# EAGLE design moduloAcionamento2 (EAGLE 9.5.2)
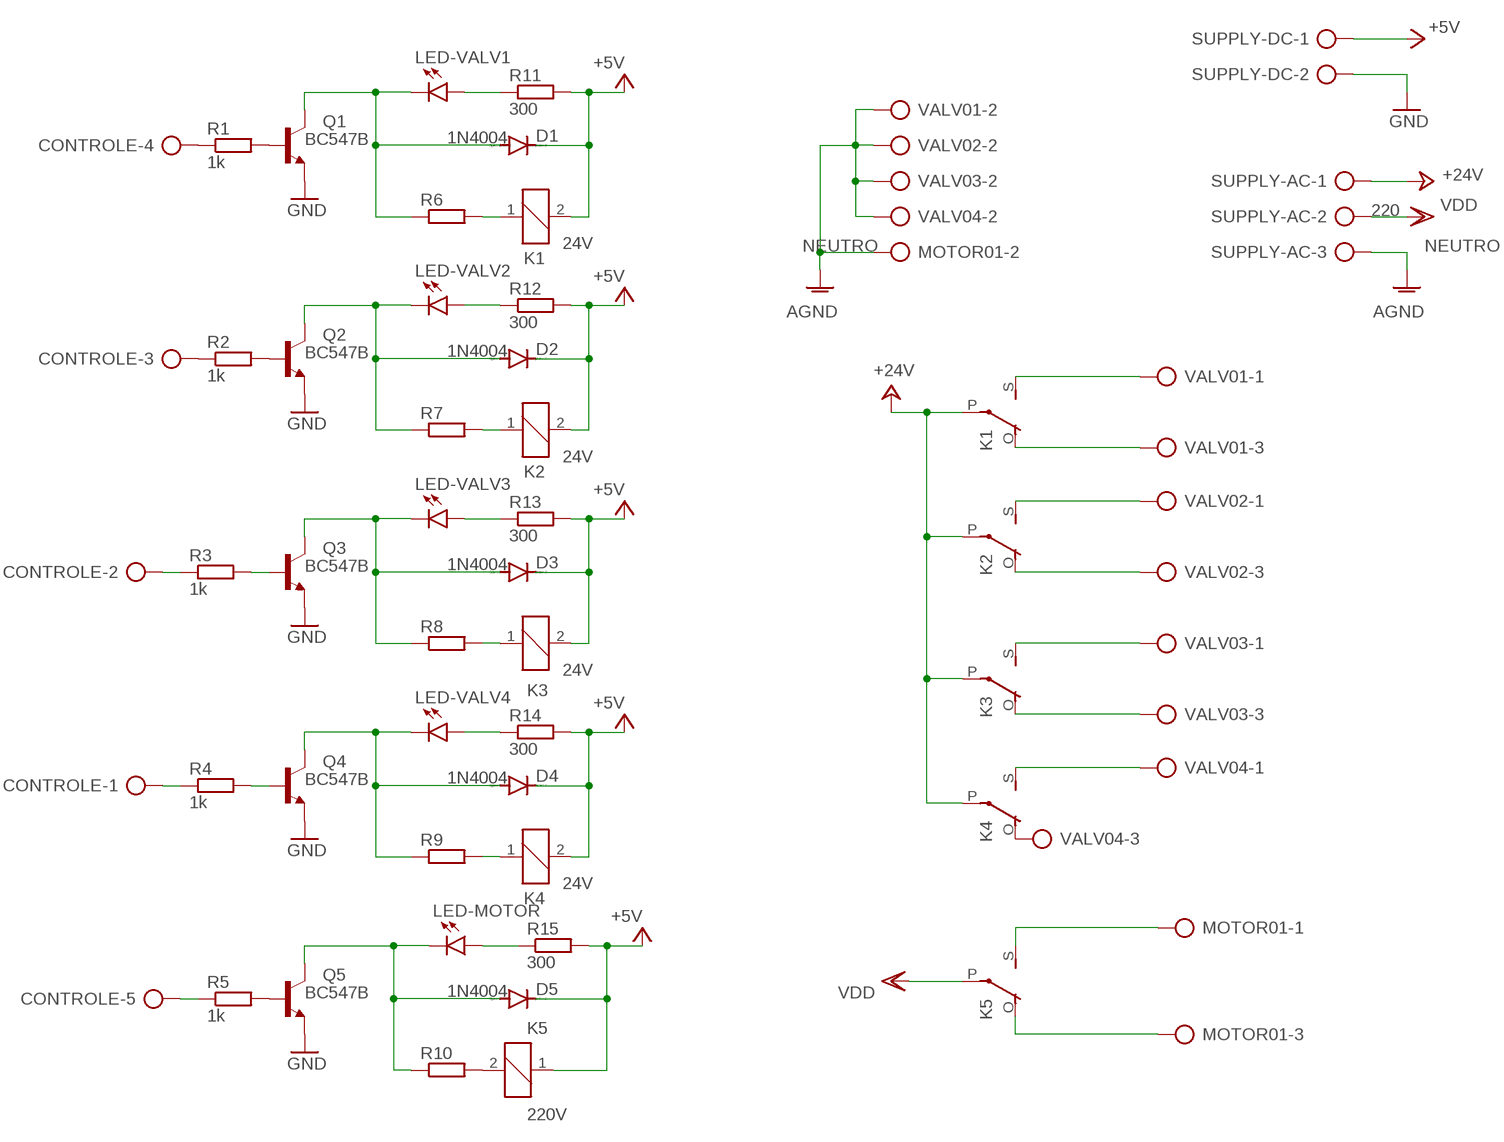
[diagram p0: schematic, sheet 1]

## Parts
CONTROLE  AK500/5  [AK500/5]
D1  1N4004  [DO41-10]
D2  1N4004  [DO41-10]
D3  1N4004  [DO41-10]
D4  1N4004  [DO41-10]
D5  1N4004  [DO41-10]
K1  24V  G5L  [G5LE]
K2  24V  G5L  [G5LE]
K3  24V  G5L  [G5LE]
K4  24V  G5L  [G5LE]
K5  220V  G5L  [G5LE]
LED-MOTOR  LED5MM  [LED5MM]
LED-VALV1  LED5MM  [LED5MM]
LED-VALV2  LED5MM  [LED5MM]
LED-VALV3  LED5MM  [LED5MM]
LED-VALV4  LED5MM  [LED5MM]
MOTOR01  AK500/3  [AK500/3]
Q1  BC547B  [TO92]
Q2  BC547B  [TO92]
Q3  BC547B  [TO92]
Q4  BC547B  [TO92]
Q5  BC547B  [TO92]
R1  1k  R-EU_0204/7  [0204/7]
R2  1k  R-EU_0204/7  [0204/7]
R3  1k  R-EU_0204/7  [0204/7]
R4  1k  R-EU_0204/7  [0204/7]
R5  1k  R-EU_0204/7  [0204/7]
R6  R-EU_0204/7  [0204/7]
R7  R-EU_0204/7  [0204/7]
R8  R-EU_0204/7  [0204/7]
R9  R-EU_0204/7  [0204/7]
R10  R-EU_0204/7  [0204/7]
R11  300  R-EU_0204/7  [0204/7]
R12  300  R-EU_0204/7  [0204/7]
R13  300  R-EU_0204/7  [0204/7]
R14  300  R-EU_0204/7  [0204/7]
R15  300  R-EU_0204/7  [0204/7]
SUPPLY-AC  AK500/3  [AK500/3]
SUPPLY-DC  AK500/2  [AK500/2]
VALV01  AK500/3  [AK500/3]
VALV02  AK500/3  [AK500/3]
VALV03  AK500/3  [AK500/3]
VALV04  AK500/3  [AK500/3]

## Nets
220: K5.P(2:P) SUPPLY-AC.2 ; supply symbol labelled VDD
+5V: D1.C D2.C D3.C D4.C D5.C K1.2 K2.2 K3.2 K4.2 K5.1 R11.2 R12.2 R13.2 R14.2 R15.2 SUPPLY-DC.1
+24V: K1.P(2:P) K2.P(2:P) K3.P(2:P) K4.P(2:P) SUPPLY-AC.1
GND: Q1.1(E) Q2.1(E) Q3.1(E) Q4.1(E) Q5.1(E) SUPPLY-DC.2
N$1: Q1.2(B) R1.2
N$2: K1.1 R6.2
N$3: D2.A LED-VALV2.K(C) Q2.3(C) R7.1
N$4: CONTROLE.4 R1.1
N$5: K3.1 R8.2
N$6: LED-VALV1.A R11.1
N$7: CONTROLE.3 R2.1
N$8: Q2.2(B) R2.2
N$9: Q3.2(B) R3.2
N$10: D4.A LED-VALV4.K(C) Q4.3(C) R9.1
N$11: CONTROLE.2 R3.1
N$12: CONTROLE.1 R4.1
N$13: Q4.2(B) R4.2
N$14: CONTROLE.5 R5.1
N$15: Q5.2(B) R5.2
N$16: K1.O(2:O) VALV01.3
N$17: K1.S(2:S) VALV01.1
N$18: K2.S(2:S) VALV02.1
N$19: K2.O(2:O) VALV02.3
N$20: K3.S(2:S) VALV03.1
N$21: K3.O(2:O) VALV03.3
N$22: K4.S(2:S) VALV04.1
N$23: K4.O(2:O) VALV04.3
N$24: K5.S(2:S) MOTOR01.1
N$25: LED-VALV2.A R12.1
N$26: K2.1 R7.2
N$27: K4.1 R9.2
N$28: D5.A LED-MOTOR.K(C) Q5.3(C) R10.1
N$29: K5.2 R10.2
N$30: LED-VALV3.A R13.1
N$31: LED-VALV4.A R14.1
N$32: D1.A LED-VALV1.K(C) Q1.3(C) R6.1
N$33: D3.A LED-VALV3.K(C) Q3.3(C) R8.1
N$34: LED-MOTOR.A R15.1
N$35: K5.O(2:O) MOTOR01.3
NEUTRO: MOTOR01.2 SUPPLY-AC.3 VALV01.2 VALV02.2 VALV03.2 VALV04.2 ; supply symbol labelled AGND

## Library data of the parts
CONTROLE = con-ptr500:AK500/5: CONNECTOR; OC_FARNELL: unknown; OC_NEWARK: unknown
D1-D5 = diode:1N4004: DIODE general purpose rectifier, 1 A
K1-K5 = relay:G5L: RELAY 1 x switch, 10 A/120 V AC, 8 A/30 V ADC, Omron; OC_FARNELL: unknown; OC_NEWARK: unknown
LED-MOTOR LED-VALV1-LED-VALV4 = led:LED: LED OSRAM: - CHIPLED LG R971, LG N971, LY N971, LG Q971, LY Q971, LO R971, LY R971 LH N974, LH R974 LS Q976, LO Q976, LY Q976 LO Q996 - Hyper CHIPLED LW Q18S LB Q993, LB Q99A, LB R99A - SideLED LS A670, LO A670, LY A670, LG A670, LP A670 LB A673, LV A673, LT A673, LW A673 LH A674 LY A675 LS A676, LA A676, LO A676, LY A676, LW A676 LS A679, LY A679, LG A679 - Hyper Micro SIDELED® LS Y876, LA Y876, LO Y876, LY Y876 LT Y87S - SmartLED LW L88C, LW L88S LB L89C, LB L89S, LG L890 LS L89K, LO L89K, LY L89K LS L896, LA L896, LO L896, LY L896 - TOPLED LS T670, LO T670, LY T670, LG T670, LP T670 LSG T670, LSP T670, LSY T670, LOP T670, LYG T670 LG T671, LOG T671, LSG T671 LB T673, LV T673, LT T673, LW T673 LH T674 LS T676, LA T676, LO T676, LY T676, LB T676, LH T676, LSB T676, LW T676 LB T67C, LV T67C, LT T67C, LS T67K, LO T67K, LY T67K, LW E67C LS E67B, LA E67B, LO E67B, LY E67B, LB E67C, LV E67C, LT E67C LW T67C LS T679, LY T679, LG T679 LS T770, LO T770, LY T770, LG T770, LP T770 LB T773, LV T773, LT T773, LW T773 LH T774 LS E675, LA E675, LY E675, LS T675 LS T776, LA T776, LO T776, LY T776, LB T776 LHGB T686 LT T68C, LB T68C - Hyper Mini TOPLED® LB M676 - Mini TOPLED Santana® LG M470 LS M47K, LO M47K, LY M47K Source: http://www.osram.convergy.de LUXEON: - LUMILED® LXK2-PW12-R00, LXK2-PW12-S00, LXK2-PW14-U00, LXK2-PW14-V00 LXK2-PM12-R00, LXK2-PM12-S00, LXK2-PM14-U00 LXK2-PE12-Q00, LXK2-PE12-R00, LXK2-PE12-S00, LXK2-PE14-T00, LXK2-PE14-U00 LXK2-PB12-K00, LXK2-PB12-L00, LXK2-PB12-M00, LXK2-PB14-N00, LXK2-PB14-P00, LXK2-PB14-Q00 LXK2-PR12-L00, LXK2-PR12-M00, LXK2-PR14-Q00, LXK2-PR14-R00 LXK2-PD12-Q00, LXK2-PD12-R00, LXK2-PD12-S00 LXK2-PH12-R00, LXK2-PH12-S00 LXK2-PL12-P00, LXK2-PL12-Q00, LXK2-PL12-R00 Source: www.luxeon.com KINGBRIGHT: KA-3528ASYC Source: www.kingbright.com
MOTOR01 SUPPLY-AC VALV01-VALV04 = con-ptr500:AK500/3: CONNECTOR; OC_FARNELL: unknown; OC_NEWARK: unknown
Q1-Q5 = transistor-npn:BC547*: NPN Transistor
R1-R15 = rcl:R-EU_: RESISTOR, European symbol; SPICEPREFIX: R
SUPPLY-DC = con-ptr500:AK500/2: CONNECTOR; OC_FARNELL: unknown; OC_NEWARK: unknown

## Board
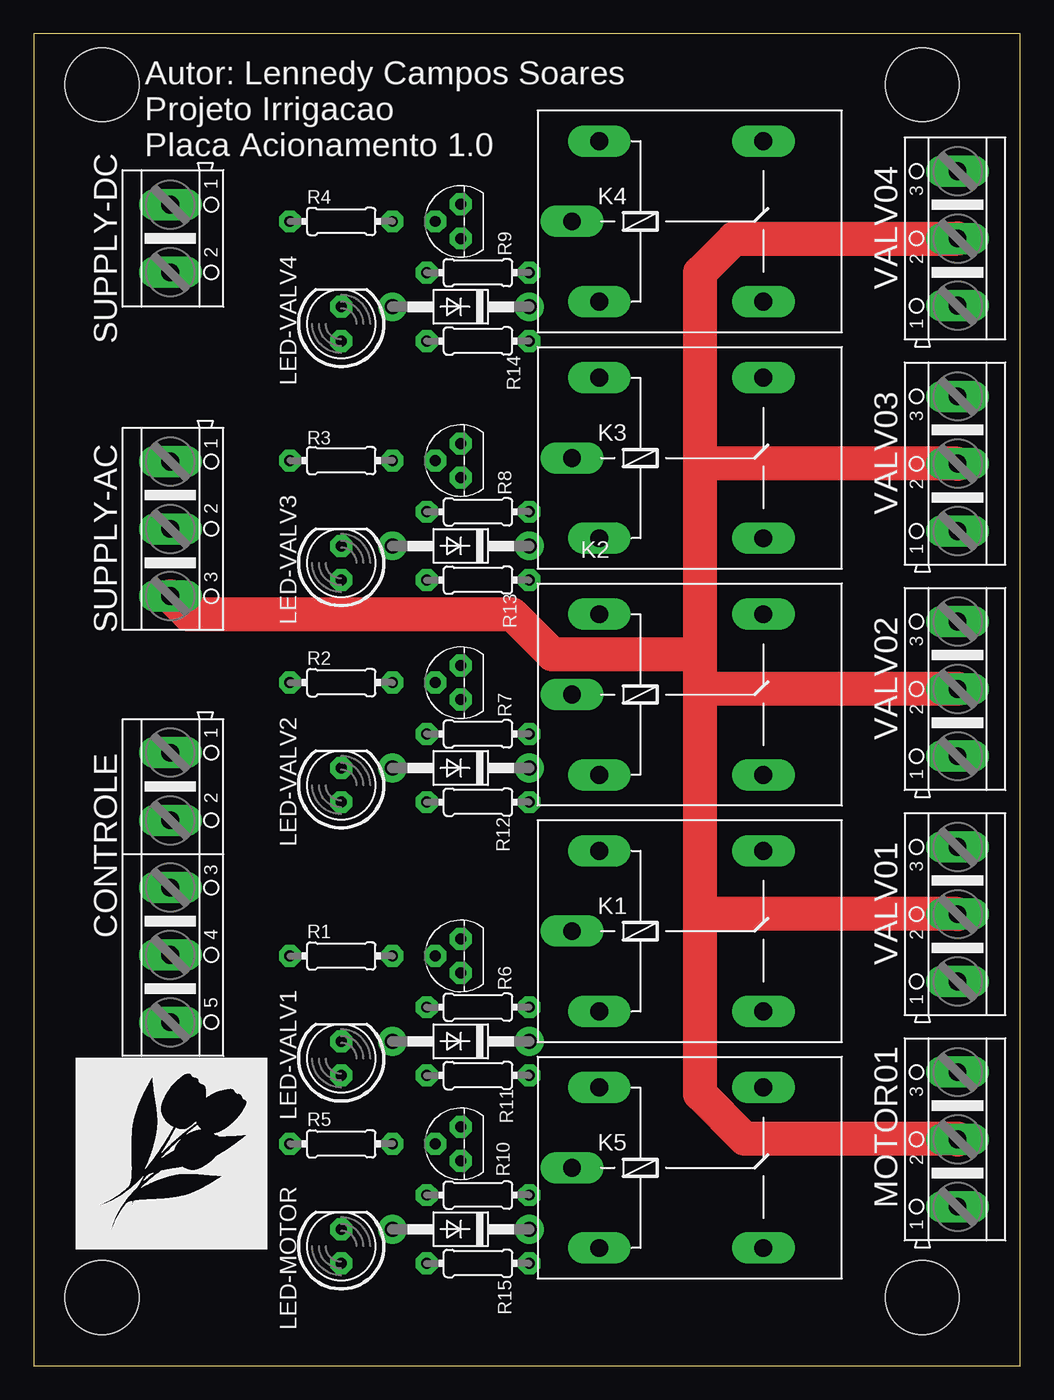
[diagram p1: board, top side]
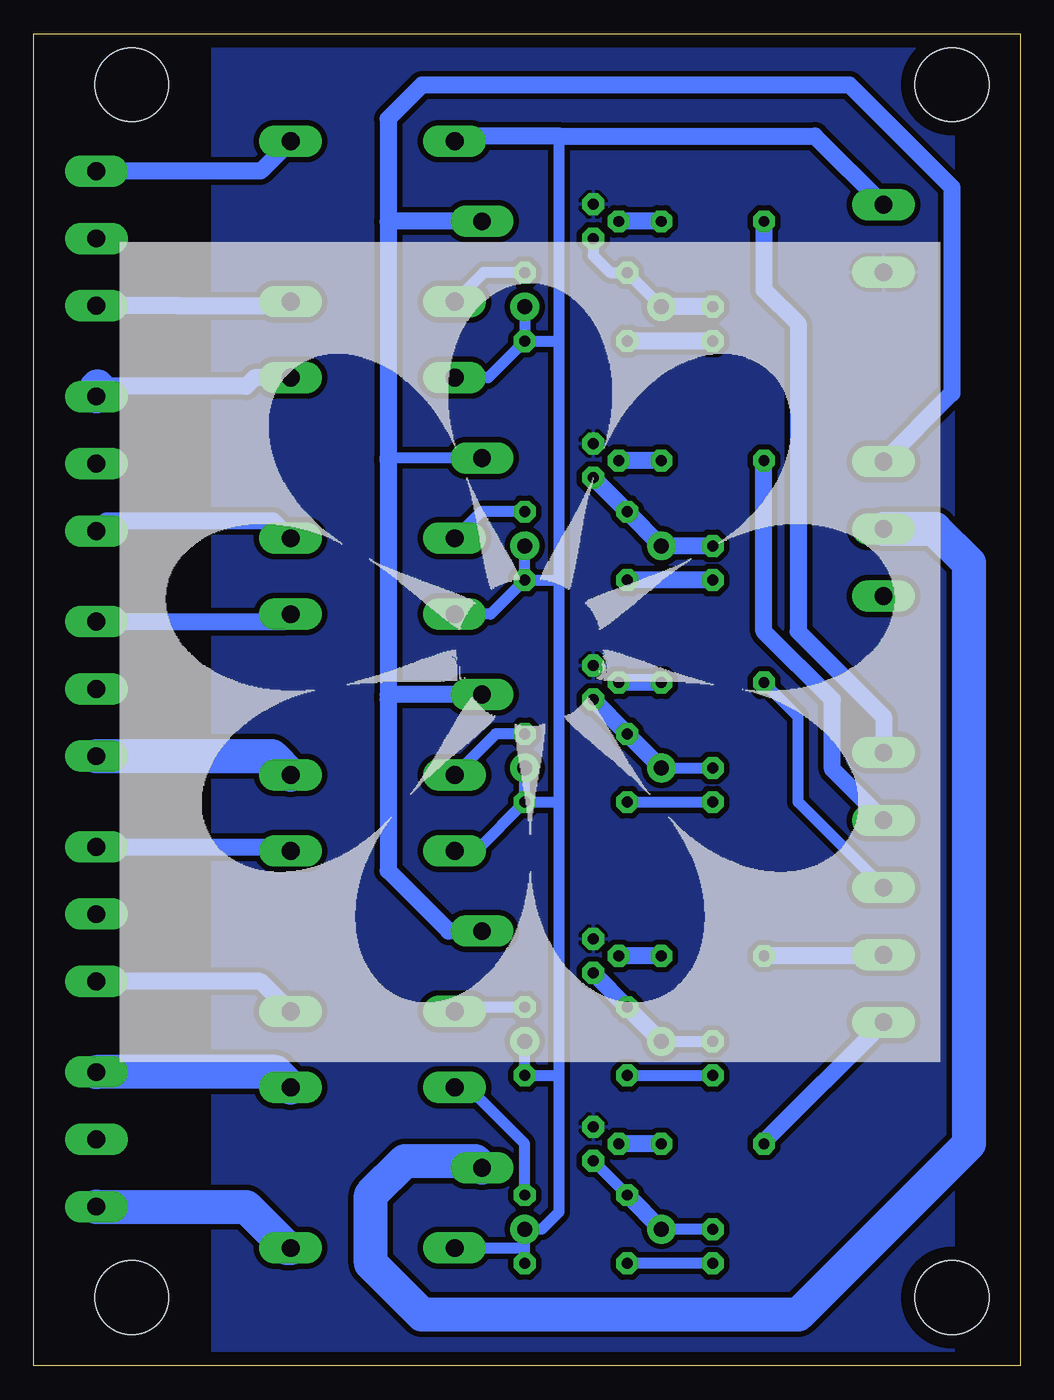
[diagram p2: board, bottom side, seen from below]

Size 73.33 x 99.05 mm. Coordinates in mm from the lower left corner, seen from the top.
Outline: 0,0 73.33,0 73.33,99.05 0,99.05 0,0
Copper layers (1*16): Top 0.035mm / dielectric 1.5mm / Bottom 0.035mm
Design rules "default *": minimum track width 6mil, minimum drill 0.35mm, track to track 16mil, track to pad 16mil, pad to pad 16mil, via to via 16mil, smd to smd 6mil, copper to edge 40mil, drill to drill 6mil, minimum pad ring 10mil, minimum via ring 8mil, stop-mask expansion 4mil, vias tented up to drill 0mil, thermal gap 10mil
Holes 5.5 mm at 5.08,95.25 5.08,5.08 66.04,5.08 66.04,95.25

### Footprints (pad centres in the part's own frame; a part is rotated, then mirrored left to right if it is on the bottom)
AK500/5 = drill 1.321 long: 1 -10.033,0; 2 -5.004,0; 3 0,0; 4 5.004,0; 5 10.008,0
DO41-10 = drill 1.118: A 5.08,0; C -5.08,0
G5LE = drill 1.321 long: 1 -7.493,-5.969; 2 -7.493,5.969; O 4.699,5.969; P -9.525,0; S 4.699,-5.969
LED5MM = drill 0.813 octagon: A -1.27,0; K 1.27,0
AK500/3 = drill 1.321 long: 1 -5.004,0; 2 0,0; 3 5.004,0
TO92 = drill 0.813 octagon: 1 1.27,0; 2 0,1.905; 3 -1.27,0
0204/7 = drill 0.813 octagon: 1 -3.81,0; 2 3.81,0
AK500/2 = drill 1.321 long: 1 -2.515,0; 2 2.515,0

### Placement (x,y rotation side)
CONTROLE  10.16,35.56 270 top
D1  31.75,24.13 180 top
D2  31.75,44.45 180 top
D3  31.75,60.96 180 top
D4  31.75,78.74 180 top
D5  31.75,10.16 180 top
K1  49.53,32.32 0 top
K2  49.53,49.91 0 top
K3  49.53,67.5 0 top
K4  49.53,85.09 0 top
K5  49.53,14.73 0 top
LED-MOTOR  22.86,8.89 90 top
LED-VALV1  22.86,22.86 90 top
LED-VALV2  22.86,43.18 90 top
LED-VALV3  22.86,59.69 90 top
LED-VALV4  22.86,77.47 90 top
MOTOR01  68.67,16.84 90 top
Q1  31.75,30.48 90 top
Q2  31.75,50.8 90 top
Q3  31.75,67.31 90 top
Q4  31.75,85.09 90 top
Q5  31.75,16.51 90 top
R1  22.86,30.48 0 top
R2  22.86,50.8 0 top
R3  22.86,67.31 0 top
R4  22.86,85.09 0 top
R5  22.86,16.51 0 top
R6  33.02,26.67 0 top
R7  33.02,46.99 0 top
R8  33.02,63.5 0 top
R9  33.02,81.28 0 top
R10  33.02,12.7 0 top
R11  33.02,21.59 0 top
R12  33.02,41.91 0 top
R13  33.02,58.42 0 top
R14  33.02,76.2 0 top
R15  33.02,7.62 0 top
SUPPLY-AC  10.16,62.23 270 top
SUPPLY-DC  10.16,83.82 270 top
VALV01  68.67,33.59 90 top
VALV02  68.67,50.33 90 top
VALV03  68.67,67.08 90 top
VALV04  68.67,83.82 90 top

### Tracks (layer width: path | path; a pad name or v marks a point on that pad's centre or on a via)
220
  Bottom 2.54: K5.P 40.51,15.24 45.72,15.24 48.26,12.7 48.26,7.62 44.45,3.81 16.51,3.81 3.81,16.51 3.81,59.69 6.35,62.23 SUPPLY-AC.2
+5V
  Bottom 0.813: R15.2 36.83,8.89 | 36.83,8.89 D5.C 35.56,10.16 34.29,11.43 34.29,21.59 | D4.C R14.2 | K3.2 39.56,73.47 R14.2 | R14.2 34.29,76.2 | 34.29,76.2 34.29,58.42 | R13.2 39.37,55.88 K2.2 | R13.2 D3.C | R13.2 34.29,58.42 | 34.29,58.42 34.29,41.91 | 34.29,41.91 34.29,21.59 | K5.1 36.96,8.76 36.83,8.89 | 34.29,21.59 R11.2 D1.C | R12.2 34.29,41.91 | R12.2 D2.C | R12.2 40.45,38.29 K1.2 | 34.29,91.44 34.29,76.2
  Bottom 1.27: K4.2 42.04,91.31 41.91,91.44 34.29,91.44 15.27,91.44 SUPPLY-DC.1
+24V
  Bottom 0.813: K3.P 46.99,67.5
  Bottom 1.27: 46.99,85.09 46.99,67.5 46.99,67.31 46.99,49.91 | 46.99,49.91 46.99,49.53 46.99,36.83 42.48,32.32 K1.P | K4.P 46.99,85.09 | K2.P 46.99,49.91 | 46.99,85.09 46.99,92.71 44.45,95.25 12.7,95.25 5.08,87.63 5.08,72.31 SUPPLY-AC.1
GND
  pour Bottom: 4.95,99.06 4.95,0 60.07,0 60.07,99.06
N$1
  Bottom 1.27: R1.2 Q1.2
N$2
  Bottom 0.813: R6.2 41.72,26.67 K1.1
N$3
  Bottom 0.813: D2.A LED-VALV2.K
  Bottom 1.27: D2.A R7.1 Q2.3
N$4
  Bottom 1.27: CONTROLE.4 10.24,30.48 R1.1
N$5
  Bottom 0.813: R8.2 40.07,63.5 K3.1
N$6
  Bottom 0.813: R11.1 LED-VALV1.A
N$7
  Bottom 0.813: CONTROLE.3 16.51,41.91 16.51,48.26 R2.1
N$8
  Bottom 1.27: R2.2 Q2.2
N$9
  Bottom 1.27: R3.2 Q3.2
N$10
  Bottom 0.813: Q4.3 31.75,82.55 30.48,81.28 R9.1 D4.A
  Bottom 1.27: LED-VALV4.K D4.A
N$11
  Bottom 1.27: CONTROLE.2 13.97,44.37 13.97,49.53 19.05,54.61 R3.1
N$12
  Bottom 1.27: CONTROLE.1 10.16,48.26 16.51,54.61 16.51,77.47 19.05,80.01 R4.1
N$13
  Bottom 1.27: R4.2 Q4.2
N$14
  Bottom 1.27: CONTROLE.5 19.05,16.66 R5.1
N$15
  Bottom 1.27: R5.2 Q5.2
N$16
  Bottom 1.27: VALV01.3 54.53,38.59 K1.O
N$17
  Bottom 1.27: K1.S 56.46,28.58 VALV01.1
N$18
  Bottom 2.54: VALV02.1 55.61,45.33 K2.S
N$19
  Bottom 1.27: VALV02.3 54.78,55.33 K2.O
N$20
  Bottom 1.27: K3.S 55.54,62.84 67.9,62.84 VALV03.1
N$21
  Bottom 1.27: K3.O 56.9,73.47 57.54,72.83 68.58,72.83
  Bottom 2.54: VALV03.3 68.67,72.74 68.58,72.83
N$22
  Bottom 1.27: VALV04.1 62.59,78.82 62.58,78.83 54.52,78.83 K4.S
N$23
  Bottom 1.27: K4.O 56.46,88.82 VALV04.3
N$24
  Bottom 2.54: MOTOR01.1 68.64,11.81 57.53,11.81 54.48,8.76 K5.S
N$25
  Bottom 0.813: R12.1 LED-VALV2.A
N$26
  Bottom 0.813: R7.2 38.99,46.99 K2.1
N$27
  Bottom 0.813: R9.2 39.88,81.28 K4.1
N$28
  Bottom 0.813: R10.1 Q5.3 | LED-MOTOR.K D5.A
  Bottom 1.27: R10.1 D5.A
N$29
  Bottom 0.813: R10.2 36.83,16.51 41.02,20.7 K5.2
N$30
  Bottom 1.27: LED-VALV3.A R13.1
N$31
  Bottom 1.27: LED-VALV4.A R14.1
N$32
  Bottom 0.813: D1.A LED-VALV1.K
  Bottom 1.27: D1.A R6.1 Q1.3
N$33
  Bottom 1.27: Q3.3 R8.1 D3.A LED-VALV3.K
N$34
  Bottom 0.813: LED-MOTOR.A R15.1
N$35
  Bottom 2.54: K5.O 55.37,21.84 MOTOR01.3
NEUTRO
  Top 2.54: 49.53,33.4 49.53,20.21 52.85,16.89 68.67,16.89 MOTOR01.2 | 49.53,33.4 49.53,50.33 | 49.53,50.33 49.53,52.07 | 49.53,52.07 49.53,67.08 | 49.53,67.08 49.53,81.28 52.07,83.82 VALV04.2 | VALV03.2 49.53,67.08 | VALV02.2 49.53,50.33 | 49.53,52.07 48.69,52.91 38.53,52.91 35.56,55.88 11.45,55.88 11.45,55.93 SUPPLY-AC.3 | VALV01.2 49.71,33.59 49.53,33.4

### Text on the board
tNames: Autor: Lennedy Campos Soares | Projeto Irrigacao / Placa Acionamento 1.0